# Altium schematic sheet 02 BLOCK DIAGRAM.SchDoc: BLOCK DIAGRAM
size 420 x 297 mm; SheetNumber: 2; SheetTotal: 10
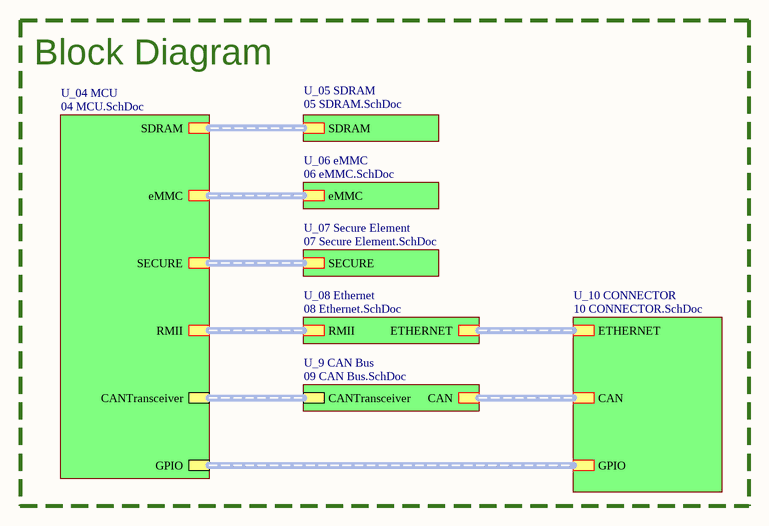
[diagram p0: 02 BLOCK DIAGRAM.SchDoc]

## Sub-sheets
U_04 MCU = 04 MCU.SchDoc: SDRAM (harness SDRAM), eMMC (harness eMMC), SECURE (harness SECURE ELEMENT), RMII (harness RMII), CANTransceiver (harness CAN), GPIO (harness GPIO)
U_05 SDRAM = 05 SDRAM.SchDoc: SDRAM (harness SDRAM)
U_06 eMMC = 06 eMMC.SchDoc: eMMC (harness eMMC)
U_07 Secure Element = 07 Secure Element.SchDoc: SECURE (harness SECURE ELEMENT)
U_08 Ethernet = 08 Ethernet.SchDoc: ETHERNET (harness ETHERNET), RMII (harness RMII)
U_9 CAN Bus = 09 CAN Bus.SchDoc: CAN (harness CAN Bus), CANTransceiver (harness CAN)
U_10 CONNECTOR = 10 CONNECTOR.SchDoc: ETHERNET (harness ETHERNET), CAN (harness CAN Bus), GPIO (harness GPIO)

## Buses and harness runs
harness sheet U_04 MCU/CANTransceiver = sheet U_9 CAN Bus/CANTransceiver
harness sheet U_04 MCU/eMMC = sheet U_06 eMMC/eMMC
harness sheet U_04 MCU/GPIO = sheet U_10 CONNECTOR/GPIO
harness sheet U_04 MCU/RMII = sheet U_08 Ethernet/RMII
harness sheet U_04 MCU/SDRAM = sheet U_05 SDRAM/SDRAM
harness sheet U_04 MCU/SECURE = sheet U_07 Secure Element/SECURE
harness sheet U_08 Ethernet/ETHERNET = sheet U_10 CONNECTOR/ETHERNET
harness sheet U_9 CAN Bus/CAN = sheet U_10 CONNECTOR/CAN

## Notes on the sheet
- Block Diagram
- Title
- Project
- Size
- Date
- Revision
- A3
- Designed By